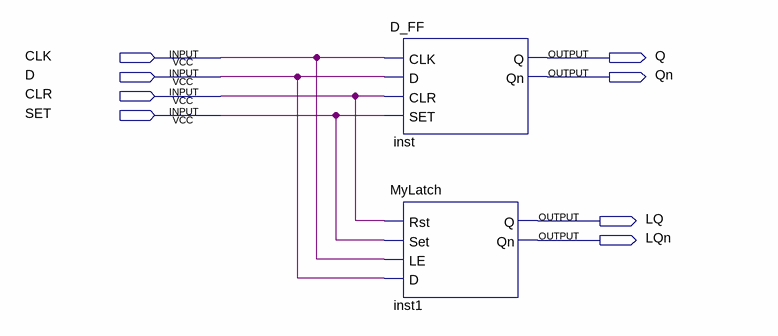
[diagram p0: schematic sheet]
// Quartus schematic D_FF_test.bdf as structural Verilog: 2 symbols, 8 pins
module D_FF_test (
  input  CLK,
  input  D,
  input  CLR,
  input  SET,
  output Q,
  output Qn,
  output LQ,
  output LQn
);

  D_FF inst (.CLK(CLK), .D(D), .CLR(CLR), .SET(SET), .Q(Q), .Qn(Qn));
  MyLatch inst1 (.Rst(CLR), .Set(SET), .LE(CLK), .D(D), .Q(LQ), .Qn(LQn));
endmodule
